# Altium schematic sheet CONTROLLER_TOP.SchDoc
size A3; ApprovedBy: D. Grossman; CheckedBy: G. Engel; Author: Y. Yakov; CompanyName: LightSense; DrawnBy: Y. Yakov; Engineer: Y.Yakov; Organization: LightSense
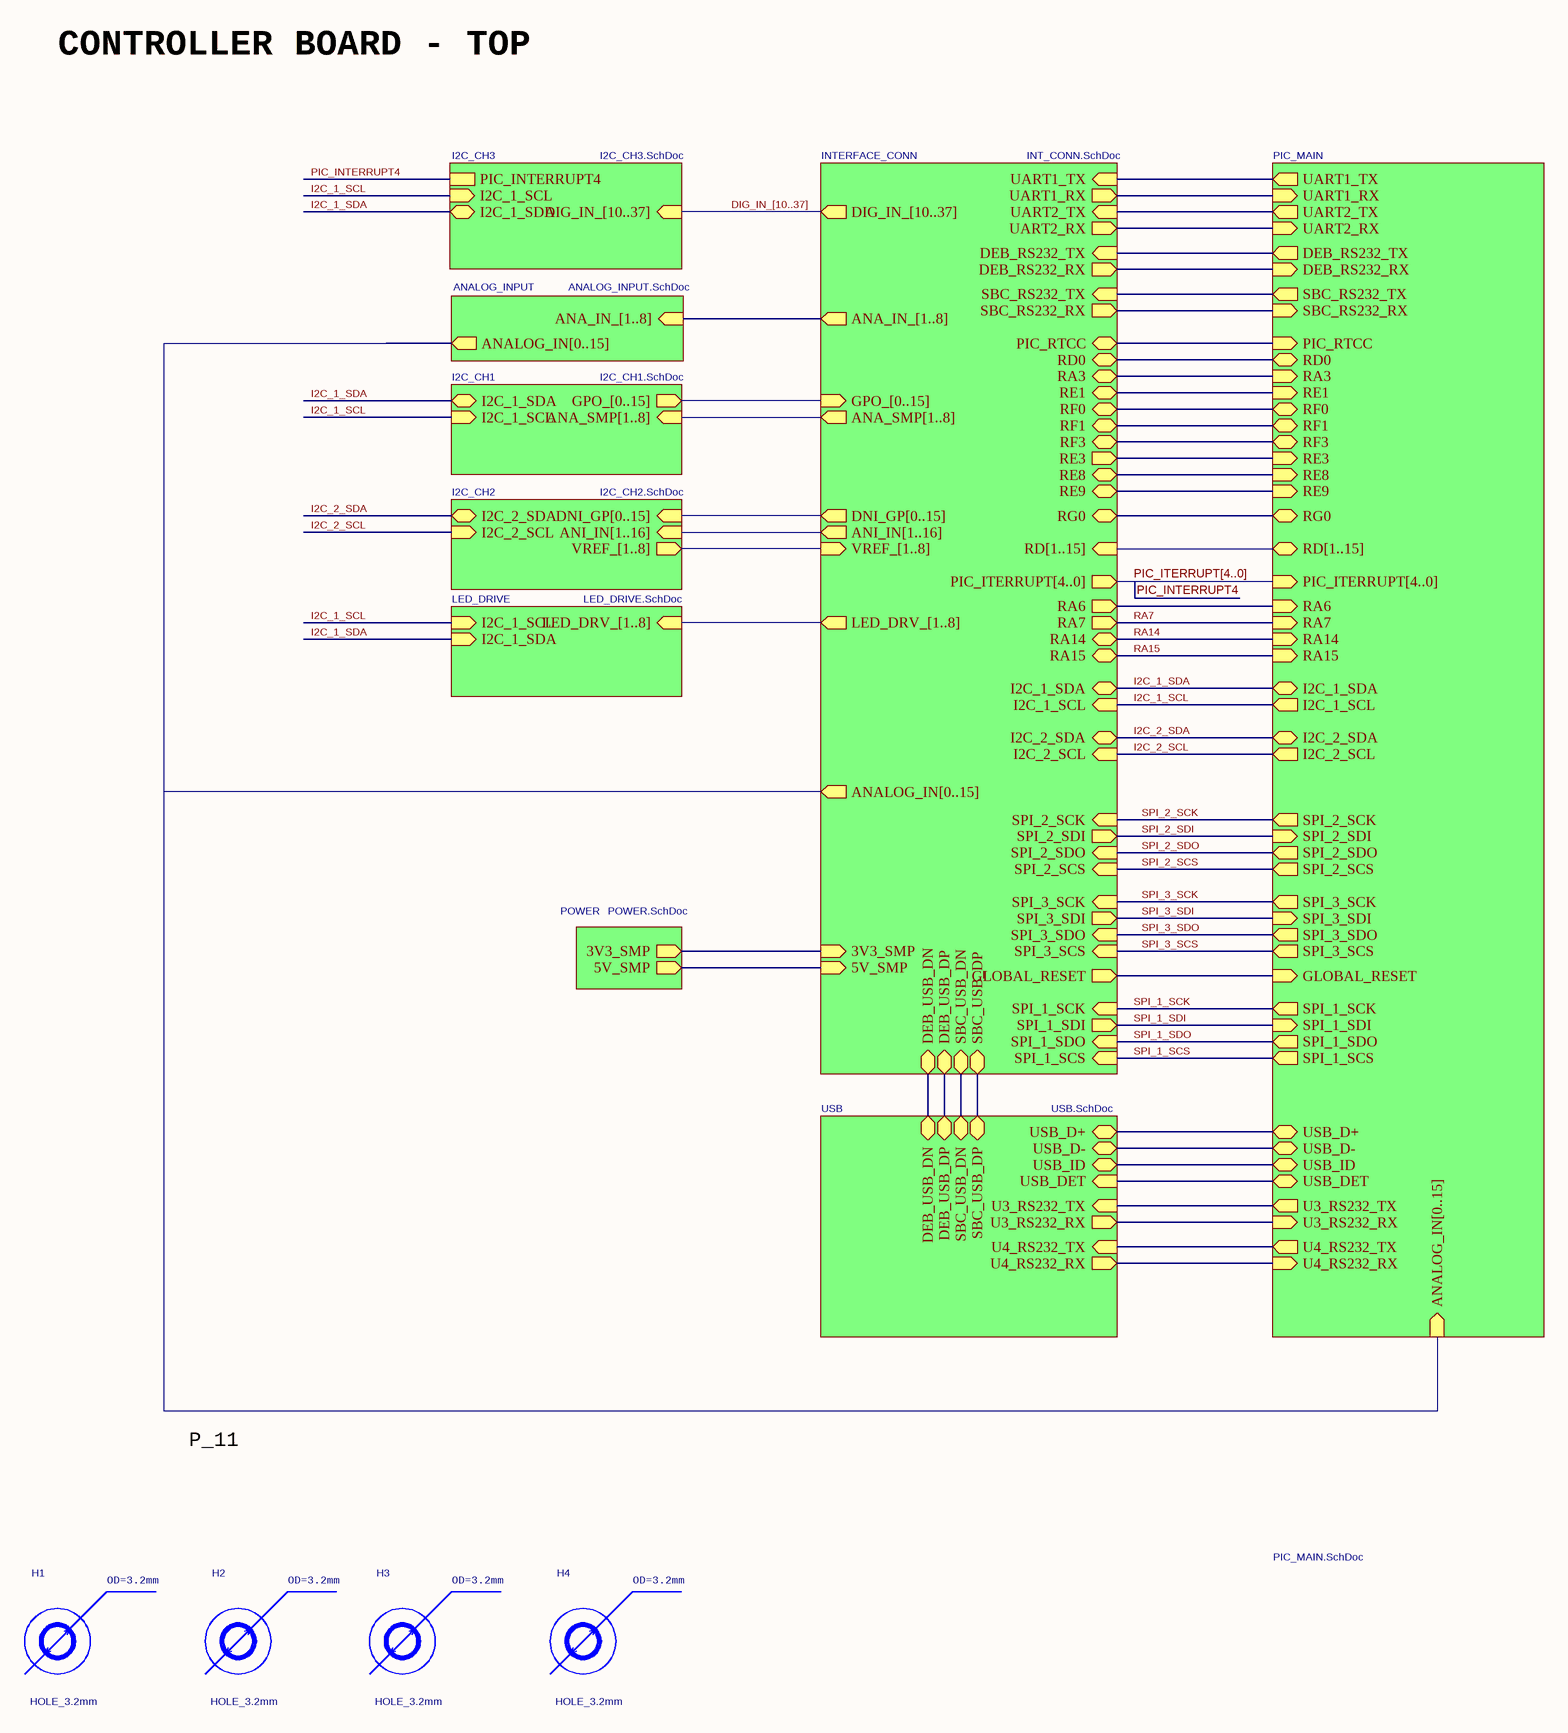
[diagram p0: CONTROLLER_TOP.SchDoc]

## Parts
H1  HOLE_3.2mm  [HOLE_3.2mm]
H2  HOLE_3.2mm  [HOLE_3.2mm]
H3  HOLE_3.2mm  [HOLE_3.2mm]
H4  HOLE_3.2mm  [HOLE_3.2mm]

## Sub-sheets
ANALOG_INPUT = ANALOG_INPUT.SchDoc: ANA_IN_[1..8] (in), ANALOG_IN[0..15] (out)
I2C_CH1 = I2C_CH1.SchDoc: I2C_1_SDA (bidir), I2C_1_SCL (in), ANA_SMP[1..8] (in), GPO_[0..15] (out)
I2C_CH2 = I2C_CH2.SchDoc: I2C_2_SCL (in), I2C_2_SDA (bidir), ANI_IN[1..16] (in), DNI_GP[0..15] (in), VREF_[1..8] (out)
I2C_CH3 = I2C_CH3.SchDoc: I2C_1_SCL (in), I2C_1_SDA (bidir), DIG_IN_[10..37] (in), PIC_INTERRUPT4
INTERFACE_CONN = INT_CONN.SchDoc: I2C_2_SDA (bidir), I2C_2_SCL (in), I2C_1_SDA (bidir), I2C_1_SCL (in), RE1 (bidir), RE8 (bidir), RE9 (bidir), RA15 (bidir), RA14 (bidir), PIC_RTCC (bidir), SBC_RS232_TX (in), DEB_RS232_RX (out), SBC_RS232_RX (out), SPI_2_SCK (in), SPI_3_SCK (in), SPI_2_SDI (out), SPI_3_SDI (out), SPI_2_SDO (in), SPI_3_SDO (in), SPI_2_SCS (in), SPI_3_SCS (in), RD0 (bidir), RF0 (bidir), RF1 (bidir), RF3 (bidir), RE3 (out), RA3 (bidir), SBC_USB_DP (bidir), SBC_USB_DN (bidir), DEB_USB_DP (bidir), DEB_USB_DN (bidir), LED_DRV_[1..8] (out), ANA_SMP[1..8] (out), GPO_[0..15] (in), ANI_IN[1..16] (out), VREF_[1..8] (in), RA7 (out), UART1_TX (in), UART2_TX (in), UART1_RX (out), UART2_RX (out), SPI_1_SCK (in), SPI_1_SDO (in), SPI_1_SCS (in), SPI_1_SDI (out), RG0 (bidir), PIC_ITERRUPT[4..0] (out), DNI_GP[0..15] (out), GLOBAL_RESET (out), ANA_IN_[1..8] (out), RA6 (out), DEB_RS232_TX (in), ANALOG_IN[0..15] (out), DIG_IN_[10..37] (out), RD[1..15] (in), 3V3_SMP (in), 5V_SMP (in)
LED_DRIVE = LED_DRIVE.SchDoc: I2C_1_SCL (in), I2C_1_SDA (in), LED_DRV_[1..8] (in)
PIC_MAIN = PIC_MAIN.SchDoc: USB_D- (bidir), PIC_ITERRUPT[4..0] (in), GLOBAL_RESET (in), USB_D+ (bidir), SPI_3_SDO (out), SPI_3_SCS (out), SPI_3_SDI (in), SPI_1_SCS (out), SPI_3_SCK (out), SPI_1_SDO (out), SPI_1_SCK (out), SPI_1_SDI (in), I2C_1_SDA (bidir), I2C_2_SDA (bidir), I2C_1_SCL (out), I2C_2_SCL (out), SBC_RS232_RX (in), SBC_RS232_TX (out), DEB_RS232_TX (out), RF0 (bidir), RF1 (bidir), RF3 (bidir), USB_ID (bidir), USB_DET (bidir), U3_RS232_RX (in), U3_RS232_TX (out), U4_RS232_RX (in), U4_RS232_TX (out), SPI_2_SCS (out), SPI_2_SDO (out), SPI_2_SCK (out), SPI_2_SDI (in), RD0 (bidir), RE1 (in), RE3 (in), UART1_RX (in), UART2_RX (in), UART1_TX (out), UART2_TX (out), RA7 (in), RE9 (in), RE8 (in), RA14 (in), RA15 (in), PIC_RTCC (in), RA6 (in), RA3 (in), RG0 (bidir), DEB_RS232_RX (in), ANALOG_IN[0..15] (in), RD[1..15] (bidir)
POWER = POWER.SchDoc: 5V_SMP (out), 3V3_SMP (out)
USB = USB.SchDoc: USB_D- (bidir), USB_D+ (bidir), U4_RS232_TX (in), U4_RS232_RX (out), U3_RS232_RX (out), U3_RS232_TX (in), SBC_USB_DP (bidir), SBC_USB_DN (bidir), DEB_USB_DP (bidir), DEB_USB_DN (bidir), USB_DET (in), USB_ID (bidir)

## Nets
I2C_1_SCL: sheet LED_DRIVE/I2C_1_SCL, sheet PIC_MAIN/I2C_1_SCL, sheet I2C_CH3/I2C_1_SCL, sheet INTERFACE_CONN/I2C_1_SCL, sheet I2C_CH1/I2C_1_SCL
I2C_1_SDA: sheet LED_DRIVE/I2C_1_SDA, sheet PIC_MAIN/I2C_1_SDA, sheet I2C_CH3/I2C_1_SDA, sheet INTERFACE_CONN/I2C_1_SDA, sheet I2C_CH1/I2C_1_SDA
I2C_2_SCL: sheet PIC_MAIN/I2C_2_SCL, sheet I2C_CH2/I2C_2_SCL, sheet INTERFACE_CONN/I2C_2_SCL
I2C_2_SDA: sheet PIC_MAIN/I2C_2_SDA, sheet I2C_CH2/I2C_2_SDA, sheet INTERFACE_CONN/I2C_2_SDA
PIC_INTERRUPT4: sheet I2C_CH3/PIC_INTERRUPT4
RA7: sheet PIC_MAIN/RA7, sheet INTERFACE_CONN/RA7
RA14: sheet PIC_MAIN/RA14, sheet INTERFACE_CONN/RA14
RA15: sheet PIC_MAIN/RA15, sheet INTERFACE_CONN/RA15
SPI_1_SCK: sheet PIC_MAIN/SPI_1_SCK, sheet INTERFACE_CONN/SPI_1_SCK
SPI_1_SCS: sheet PIC_MAIN/SPI_1_SCS, sheet INTERFACE_CONN/SPI_1_SCS
SPI_1_SDI: sheet PIC_MAIN/SPI_1_SDI, sheet INTERFACE_CONN/SPI_1_SDI
SPI_1_SDO: sheet PIC_MAIN/SPI_1_SDO, sheet INTERFACE_CONN/SPI_1_SDO
SPI_2_SCK: sheet PIC_MAIN/SPI_2_SCK, sheet INTERFACE_CONN/SPI_2_SCK
SPI_2_SCS: sheet PIC_MAIN/SPI_2_SCS, sheet INTERFACE_CONN/SPI_2_SCS
SPI_2_SDI: sheet PIC_MAIN/SPI_2_SDI, sheet INTERFACE_CONN/SPI_2_SDI
SPI_2_SDO: sheet PIC_MAIN/SPI_2_SDO, sheet INTERFACE_CONN/SPI_2_SDO
SPI_3_SCK: sheet PIC_MAIN/SPI_3_SCK, sheet INTERFACE_CONN/SPI_3_SCK
SPI_3_SCS: sheet PIC_MAIN/SPI_3_SCS, sheet INTERFACE_CONN/SPI_3_SCS
SPI_3_SDI: sheet PIC_MAIN/SPI_3_SDI, sheet INTERFACE_CONN/SPI_3_SDI
SPI_3_SDO: sheet PIC_MAIN/SPI_3_SDO, sheet INTERFACE_CONN/SPI_3_SDO
(unnamed): sheet USB/USB_D-, sheet PIC_MAIN/USB_D-
(unnamed): sheet USB/USB_D+, sheet PIC_MAIN/USB_D+
(unnamed): sheet USB/U4_RS232_TX, sheet PIC_MAIN/U4_RS232_TX
(unnamed): sheet USB/U4_RS232_RX, sheet PIC_MAIN/U4_RS232_RX
(unnamed): sheet USB/U3_RS232_RX, sheet PIC_MAIN/U3_RS232_RX
(unnamed): sheet USB/U3_RS232_TX, sheet PIC_MAIN/U3_RS232_TX
(unnamed): sheet USB/SBC_USB_DP, sheet INTERFACE_CONN/SBC_USB_DP
(unnamed): sheet USB/SBC_USB_DN, sheet INTERFACE_CONN/SBC_USB_DN
(unnamed): sheet USB/DEB_USB_DP, sheet INTERFACE_CONN/DEB_USB_DP
(unnamed): sheet USB/DEB_USB_DN, sheet INTERFACE_CONN/DEB_USB_DN
(unnamed): sheet USB/USB_DET, sheet PIC_MAIN/USB_DET
(unnamed): sheet USB/USB_ID, sheet PIC_MAIN/USB_ID
(unnamed): sheet PIC_MAIN/GLOBAL_RESET, sheet INTERFACE_CONN/GLOBAL_RESET
(unnamed): sheet PIC_MAIN/SBC_RS232_RX, sheet INTERFACE_CONN/SBC_RS232_RX
(unnamed): sheet PIC_MAIN/SBC_RS232_TX, sheet INTERFACE_CONN/SBC_RS232_TX
(unnamed): sheet PIC_MAIN/DEB_RS232_TX, sheet INTERFACE_CONN/DEB_RS232_TX
(unnamed): sheet PIC_MAIN/RF0, sheet INTERFACE_CONN/RF0
(unnamed): sheet PIC_MAIN/RF1, sheet INTERFACE_CONN/RF1
(unnamed): sheet PIC_MAIN/RF3, sheet INTERFACE_CONN/RF3
(unnamed): sheet PIC_MAIN/RD0, sheet INTERFACE_CONN/RD0
(unnamed): sheet PIC_MAIN/RE1, sheet INTERFACE_CONN/RE1
(unnamed): sheet PIC_MAIN/RE3, sheet INTERFACE_CONN/RE3
(unnamed): sheet PIC_MAIN/UART1_RX, sheet INTERFACE_CONN/UART1_RX
(unnamed): sheet PIC_MAIN/UART2_RX, sheet INTERFACE_CONN/UART2_RX
(unnamed): sheet PIC_MAIN/UART1_TX, sheet INTERFACE_CONN/UART1_TX
(unnamed): sheet PIC_MAIN/UART2_TX, sheet INTERFACE_CONN/UART2_TX
(unnamed): sheet PIC_MAIN/RE9, sheet INTERFACE_CONN/RE9
(unnamed): sheet PIC_MAIN/RE8, sheet INTERFACE_CONN/RE8
(unnamed): sheet PIC_MAIN/PIC_RTCC, sheet INTERFACE_CONN/PIC_RTCC
(unnamed): sheet PIC_MAIN/RA6, sheet INTERFACE_CONN/RA6
(unnamed): sheet PIC_MAIN/RA3, sheet INTERFACE_CONN/RA3
(unnamed): sheet PIC_MAIN/RG0, sheet INTERFACE_CONN/RG0
(unnamed): sheet PIC_MAIN/DEB_RS232_RX, sheet INTERFACE_CONN/DEB_RS232_RX
(unnamed): sheet POWER/5V_SMP, sheet INTERFACE_CONN/5V_SMP
(unnamed): sheet POWER/3V3_SMP, sheet INTERFACE_CONN/3V3_SMP

## Buses and harness runs
bus DIG_IN_[10..37] = sheet I2C_CH3/DIG_IN_[10..37] = sheet INTERFACE_CONN/DIG_IN_[10..37]
bus PIC_ITERRUPT[4..0] = sheet INTERFACE_CONN/PIC_ITERRUPT[4..0] = sheet PIC_MAIN/PIC_ITERRUPT[4..0]
bus sheet ANALOG_INPUT/ANA_IN_[1..8] = sheet INTERFACE_CONN/ANA_IN_[1..8]
bus sheet I2C_CH1/ANA_SMP[1..8] = sheet INTERFACE_CONN/ANA_SMP[1..8]
bus sheet I2C_CH1/GPO_[0..15] = sheet INTERFACE_CONN/GPO_[0..15]
bus sheet I2C_CH2/ANI_IN[1..16] = sheet INTERFACE_CONN/ANI_IN[1..16]
bus sheet I2C_CH2/DNI_GP[0..15] = sheet INTERFACE_CONN/DNI_GP[0..15]
bus sheet I2C_CH2/VREF_[1..8] = sheet INTERFACE_CONN/VREF_[1..8]
bus sheet INTERFACE_CONN/ANALOG_IN[0..15] = sheet PIC_MAIN/ANALOG_IN[0..15]
bus sheet INTERFACE_CONN/LED_DRV_[1..8] = sheet LED_DRIVE/LED_DRV_[1..8]
bus sheet INTERFACE_CONN/RD[1..15] = sheet PIC_MAIN/RD[1..15]

## Notes on the sheet
- CONTROLLER BOARD - TOP
- P_11
- Description:
- Sheet
- of
- Designed
- Name
- Signature
- Date
- File:
- This drawing and any accompanying documents contain confidential information intended for a specific individual and purpose.
  This information, owned by Lightsense, is private and confidential. If you are not the intended recipient, you are hereby notified that any disclosure, copying or distribution, or the taking of any action based on the contents of this information, is strictly prohibited.
- Board Name:
- Document Version:
- Approved
- Reviewed
- (in symbol HOLE_3.2mm) OD=3.2mm